# EAGLE board OOBDpiZero (EAGLE 7.2.0), part 1 of 2
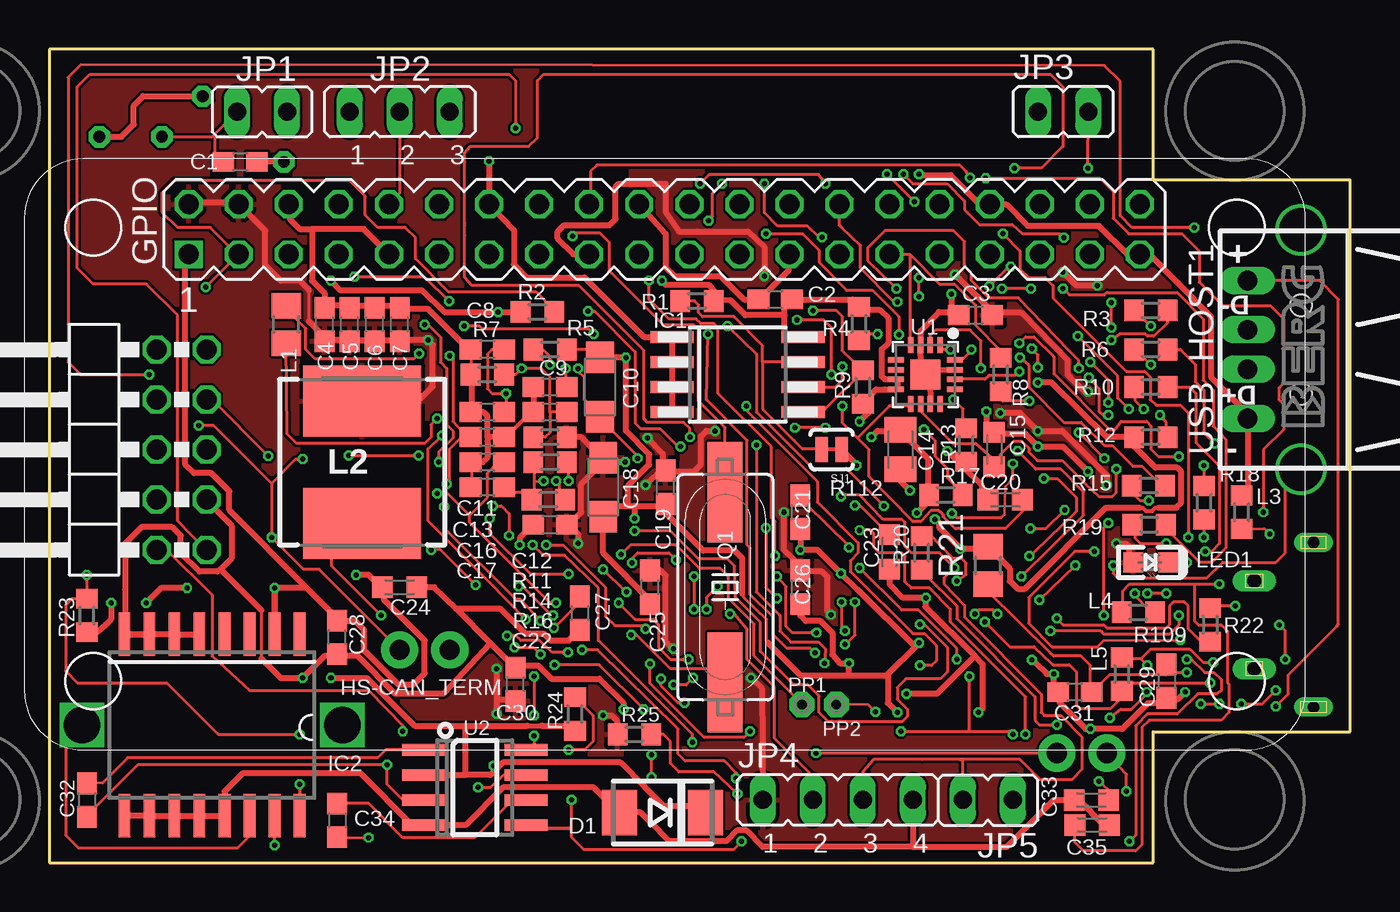
[diagram p3: board, top side]
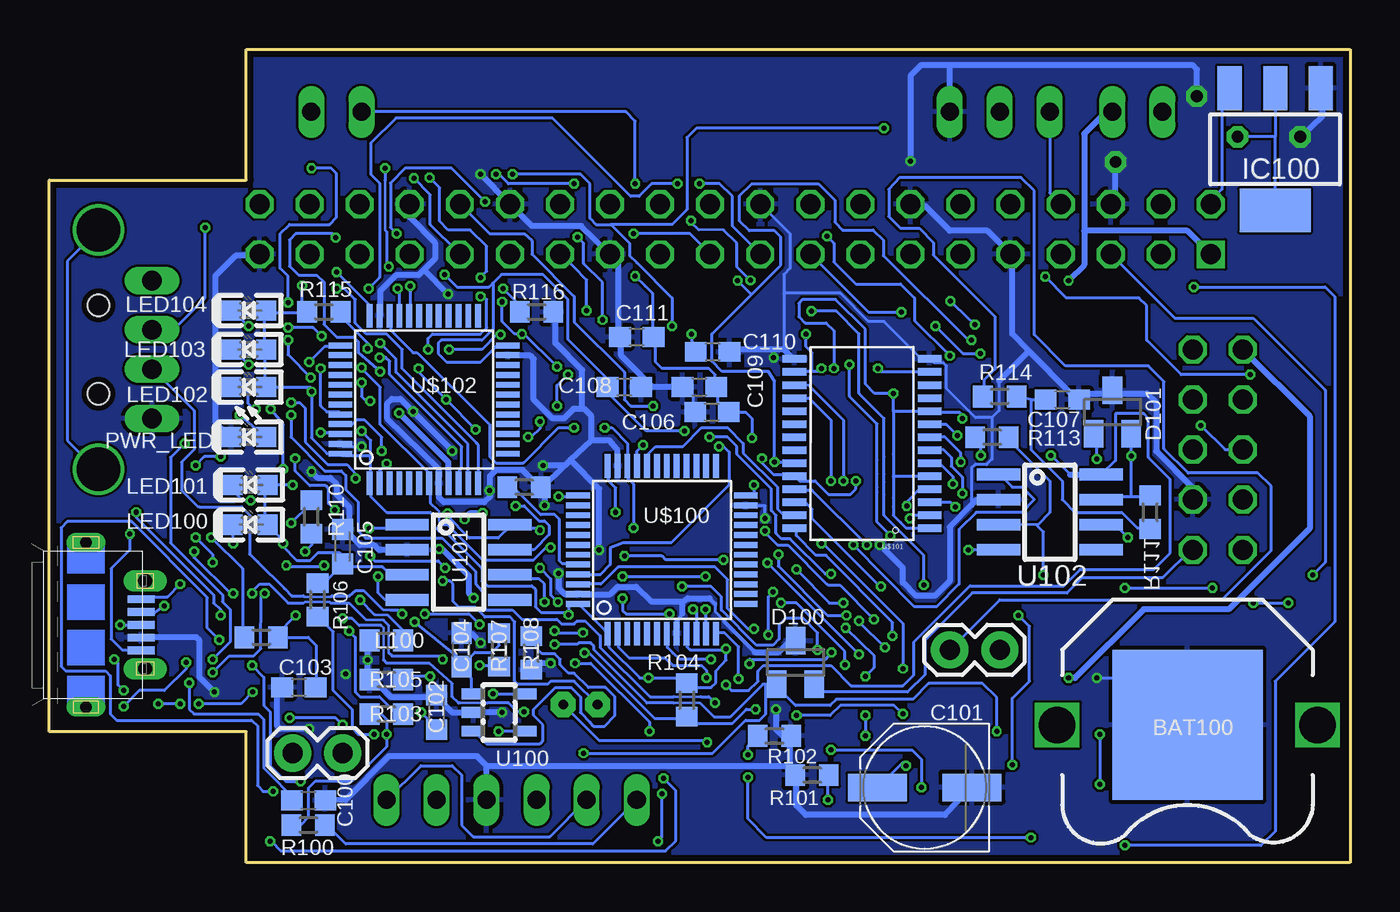
[diagram p4: board, bottom side, seen from below]

Size 66 x 41.27 mm. Coordinates in mm from the lower left corner, seen from the top.
Outline: 0,0 56,0 56,6.63 66,6.63 66,34.63 56,34.63 56,41.27 0,41.27 0,0
Copper layers (1*16): Top 0.035mm / dielectric 1.5mm / Bottom 0.035mm
Design rules "PCB-POOL HighSpec": minimum track width 0.125mm, minimum drill 0.2mm, track to track 0.125mm, track to pad 0.125mm, pad to pad 0.125mm, via to via 0.125mm, smd to smd 0.125mm, copper to edge 0.3mm, drill to drill 0.2mm, minimum pad ring 0.2mm, minimum via ring 0.125mm, stop-mask expansion 0.075mm, vias tented up to drill 0mil, thermal gap 0.2mm
Net classes: 2 lan_sh: clearance 0.762 mm

## Footprints (pad centres in the part's own frame; a part is rotated, then mirrored left to right if it is on the bottom)
BATTCON_12MM_PTH = smd 7.62 x 7.62: GND 0,0 | drill 1.854 square: VCC@1 -6.604,0; VCC@2 6.604,0
C0603 = smd 1.1 x 1: 1 -0.85,0; 2 0.85,0
SMC_A = smd 1.6 x 1.4: + -1.5,0; - 1.5,0
C0805K = smd 1.3 x 1.6: 1 -1,0; 2 1,0
C0603K = smd 1.05 x 1.08: 1 -0.875,0; 2 0.875,0
PANASONIC_D = smd 3 x 1.4: + 2.4,0; - -2.4,0
DO214AA = smd 1.778 x 2.286: A 2.177,0; C -2.177,0
SOT23 = smd 1 x 1.4: 1 -0.95,-1.1; 2 0.95,-1.1; 3 0,1.1
PIZERO_THOUGH_HOLE = drill 1.016 square: 1 8.34,25.15 | drill 1.016 octagon: 2 8.34,27.69; 3 10.88,25.15; 4 10.88,27.69; 5 13.42,25.15; 6 13.42,27.69; 7 15.96,25.15; 8 15.96,27.69; 9 18.5,25.15; 10 18.5,27.69; 11 21.04,25.15; 12 21.04,27.69; 13 23.58,25.15; 14 23.58,27.69; 15 26.12,25.15; 16 26.12,27.69; 17 28.66,25.15; 18 28.66,27.69; 19 31.2,25.15; 20 31.2,27.69; 21 33.74,25.15; 22 33.74,27.69; 23 36.28,25.15; 24 36.28,27.69; 25 38.82,25.15; 26 38.82,27.69; 27 41.36,25.15; 28 41.36,27.69; 29 43.9,25.15; 30 43.9,27.69; 31 46.44,25.15; 32 46.44,27.69; 33 48.98,25.15; 34 48.98,27.69; 35 51.52,25.15; 36 51.52,27.69; 37 54.06,25.15; 38 54.06,27.69; 39 56.6,25.15; 40 56.6,27.69
1X02 = drill 1.016 pad 1.88: 1 0,0; 2 2.54,0
SOIC8 = smd 0.6 x 2.2: 1 -1.905,-3.33; 2 -0.635,-3.33; 3 0.635,-3.33; 4 1.905,-3.33; 5 1.905,3.33; 6 0.635,3.33; 7 -0.635,3.33; 8 -1.905,3.33
SOIC-16W = smd 0.6 x 2.2: 1 -4.445,-4.6; 2 -3.175,-4.6; 3 -1.905,-4.6; 4 -0.635,-4.6; 5 0.635,-4.6; 6 1.905,-4.6; 7 3.175,-4.6; 8 4.445,-4.6; 9 4.445,4.6; 10 3.175,4.6; 11 1.905,4.6; 12 0.635,4.6; 13 -0.635,4.6; 14 -1.905,4.6; 15 -3.175,4.6; 16 -4.445,4.6
SOT223 = smd 1.219 x 2.235: 1 -2.311,-3.099; 2 0,-3.099; 3 2.311,-3.099 | smd 3.6 x 2.2: TAB 0,3.099
JP1 = drill 0.914 long: 1 0,-1.27; 2 0,1.27
JP2 = drill 0.914 long: 1 -2.54,0; 2 0,0; 3 2.54,0
JP4 = drill 0.914 long: 1 -3.81,0; 2 -1.27,0; 3 1.27,0; 4 3.81,0
L0805@1 = smd 1.3 x 1.5: 1 -0.95,0; 2 0.95,0
8X8MM_3131 = smd 3.6 x 6: 1 -3.1,0; 2 3.1,0
L0603 = smd 1 x 1.1: 1 -0.85,0; 2 0.85,0
LED_0603 = smd 1.016 x 1.016: A 0.889,0; C -0.889,0
2X05/90 = drill 1.016 octagon: 1 -5.08,-6.35; 2 -5.08,-3.81; 3 -2.54,-6.35; 4 -2.54,-3.81; 5 0,-6.35; 6 0,-3.81; 7 2.54,-6.35; 8 2.54,-3.81; 9 5.08,-6.35; 10 5.08,-3.81
P1-11 = drill 0.5 pad 1.27 octagon: P$1 0,0
LED-0603 = smd 1.016 x 1.016: A 0.889,0; C -0.889,0
SM49 = smd 5.08 x 1.778: 1 -4.826,0; 2 4.826,0
R0603 = smd 1 x 1.1: 1 -0.85,0; 2 0.85,0
R0805 = smd 1.3 x 1.5: 1 -0.95,0; 2 0.95,0
SJ_2S-TRACE = smd 0.635 x 1.27: 1 -0.508,0; 2 0.508,0
QFN16_3MM = smd 0.8 x 0.28: 1 -1.5,0.75; 2 -1.5,0.25; 3 -1.5,-0.25; 4 -1.5,-0.75; 9 1.5,-0.75; 10 1.5,-0.25; 11 1.5,0.25; 12 1.5,0.75 | smd 0.28 x 0.8: 5 -0.75,-1.5; 6 -0.25,-1.5; 7 0.25,-1.5; 8 0.75,-1.5; 13 0.75,1.5; 14 0.25,1.5; 15 -0.25,1.5; 16 -0.75,1.5 | smd 1.5 x 1.5: THERMAL 0,0
SOIC8' = smd 0.6 x 2.2: 1 -1.905,-2.6; 2 -0.635,-2.6; 3 0.635,-2.6; 4 1.905,-2.6; 5 1.905,2.6; 6 0.635,2.6; 7 -0.635,2.6; 8 -1.905,2.6
SOT23-5 = smd 1.2 x 0.55: 1 1.3,-0.95; 2 1.3,0; 3 1.3,0.95; 4 -1.3,0.95; 5 -1.3,-0.95
SO-08 = smd 0.6 x 2.2: 1 -1.905,-2.6; 2 -0.635,-2.6; 3 0.635,-2.6; 4 1.905,-2.6; 5 1.905,2.6; 6 0.635,2.6; 7 -0.635,2.6; 8 -1.905,2.6
LQFP48 = smd 0.3 x 1.2: 1 -2.75,-4.25; 2 -2.25,-4.25; 3 -1.75,-4.25; 4 -1.25,-4.25; 5 -0.75,-4.25; 6 -0.25,-4.25; 7 0.25,-4.25; 8 0.75,-4.25; 9 1.25,-4.25; 10 1.75,-4.25; 11 2.25,-4.25; 12 2.75,-4.25; 25 2.75,4.25; 26 2.25,4.25; 27 1.75,4.25; 28 1.25,4.25; 29 0.75,4.25; 30 0.25,4.25; 31 -0.25,4.25; 32 -0.75,4.25; 33 -1.25,4.25; 34 -1.75,4.25; 35 -2.25,4.25; 36 -2.75,4.25 | smd 1.2 x 0.3: 13 4.25,-2.75; 14 4.25,-2.25; 15 4.25,-1.75; 16 4.25,-1.25; 17 4.25,-0.75; 18 4.25,-0.25; 19 4.25,0.25; 20 4.25,0.75; 21 4.25,1.25; 22 4.25,1.75; 23 4.25,2.25; 24 4.25,2.75; 37 -4.25,2.75; 38 -4.25,2.25; 39 -4.25,1.75; 40 -4.25,1.25; 41 -4.25,0.75; 42 -4.25,0.25; 43 -4.25,-0.25; 44 -4.25,-0.75; 45 -4.25,-1.25; 46 -4.25,-1.75; 47 -4.25,-2.25; 48 -4.25,-2.75
TSSOP28 = smd 1.2 x 0.38: 1 -3.429,4.623; 2 -3.429,3.962; 3 -3.429,3.302; 4 -3.429,2.642; 5 -3.429,1.981; 6 -3.429,1.321; 7 -3.429,0.66; 8 -3.435,0; 9 -3.429,-0.66; 10 -3.429,-1.321; 11 -3.429,-1.981; 12 -3.429,-2.642; 13 -3.429,-3.302; 14 -3.429,-3.962; 15 3.429,-3.962; 16 3.429,-3.302; 17 3.429,-2.642; 18 3.429,-1.981; 19 3.429,-1.321; 20 3.429,-0.66; 21 3.435,0; 22 3.429,0.66; 23 3.429,1.321; 24 3.429,1.981; 25 3.429,2.642; 26 3.429,3.302; 27 3.429,3.962; 28 3.429,4.623
USB_PN87520_DEV_PTH = drill 1 long: 1 3.5,2.71; 2 1,2.71; 3 -1,2.71; 4 -3.5,2.71 | drill 2.2: P$1 6.07,0; P$2 -6.07,0 | hole 1.1: -2.25,0; 2.25,0
47589-0001 = smd 1.35 x 0.4: 1 2.8,1.3; 2 2.8,0.65; 3 2.8,0; 4 2.8,-0.65; 5 2.8,-1.3 | drill 0.6 pad 0.95 long: CASING1 0,4.175; CASING2 0,-4.175 | drill 0.7 pad 1.1 long: CASING3 3,2.225; CASING4 3,-2.225

## Placement (x,y rotation side)
BAT100  3,6V  [BATTCON_12MM_PTH]  8.26,6.98 180 bottom
C1  10uF/6.3V  [C0603]  9.68,35.56 0 top
C2  100nF  [C0603]  36.83,28.58 0 top
C3  100nF  [C0603]  46.99,27.78 0 top
C4  22uF/6.3V  [C0603]  13.97,27.31 90 top
C5  22uF/6.3V  [C0603]  15.24,27.31 90 top
C6  22uF/6.3V  [C0603]  16.51,27.31 90 top
C7  22uF/6.3V  [C0603]  17.78,27.31 90 top
C8  100nF  [C0603]  22.23,26.04 180 top
C9  100nF  [C0603]  25.4,24.13 180 top
C10  22uF/6.3V  [SMC_A]  27.94,24.13 90 top
C11  100nF  [C0603]  22.23,22.86 180 top
C12  1uF  [C0603]  25.4,22.86 180 top
C13  33pF  [C0603]  22.23,21.59 0 top
C14  10uF  [C0805K]  43.18,20.96 270 top
C15  220pF  [C0603K]  47.94,20.96 270 top
C16  33pF  [C0603]  22.23,20.32 180 top
C17  100nF  [C0603]  22.23,19.05 180 top
C18  22uF/6.3V  [SMC_A]  28.1,19.05 270 top
C19  100nF  [C0603]  31.27,19.05 90 top
C20  220pF  [C0603K]  48.5,18.42 0 top
C21  100nF  [C0603]  38.1,17.78 90 top
C22  100nF  [C0603]  25.4,17.15 180 top
C23  100nF  [C0603K]  42.62,15.76 90 top
C24  100nF  [C0603K]  17.78,13.97 0 top
C25  100nF  [C0603]  30.48,13.97 90 top
C26  100nF  [C0603]  38.1,13.97 90 top
C27  100nF  [C0603]  26.91,12.66 270 top
C28  1uF  [C0603]  14.61,11.43 90 top
C29  22uF/6.3V  [C0603]  56.67,9.21 270 top
C30  10uF/6.3V  [C0603]  23.65,9.05 90 top
C31  22uF/6.3V  [C0603]  52.03,8.65 180 top
C32  10nF  [C0603]  1.91,3.17 270 top
C33  100nF  [C0603K]  52.86,3.17 180 top
C34  3.3nF  [C0603]  14.61,2.14 270 top
C35  100nF  [C0603K]  52.9,1.91 0 top
C100  22uF/6.3V  [C0603]  52.85,3.16 0 bottom
C101  470uF/25V/LOWESR/105C  [PANASONIC_D]  21.59,3.81 180 bottom
C102  100nF  [C0603K]  46.35,7.62 90 bottom
C103  NI (10nF)  [C0603]  53.34,8.89 180 bottom
C104  22uF/6.3V  [C0603]  45.09,10.79 90 bottom
C105  100nF  [C0603K]  51.12,16.03 90 bottom
C106  100nF  [C0603]  32.38,22.86 0 bottom
C107  NI (10nF)  [C0603]  14.61,23.5 0 bottom
C108  100nF  [C0603]  36.83,24.13 180 bottom
C109  100nF  [C0603]  33.02,24.13 0 bottom
C110  100nF  [C0603]  32.35,25.92 180 bottom
C111  100nF  [C0603]  36.2,26.67 0 bottom
D1  SMBJ16A  [DO214AA]  31.11,2.54 180 top
D100  PESD1CAN  [SOT23]  28.14,10.16 0 bottom
D101  PESD1CAN  [SOT23]  12.06,22.86 0 bottom
GPIO  OOBDpiZero  [PIZERO_THOUGH_HOLE]  -1.27,5.71 0 top
HS-CAN_TERM  OPEN  [1X02]  17.78,10.79 180 bottom
IC1  EEPROM24  [SOIC8]  34.92,24.77 270 top
IC2  DS3231  [SOIC-16W]  8.26,6.98 180 top
IC100  LM1117MPX-3.3  [SOT223]  3.81,36.2 180 bottom
JP1  3V3 power (opt)  [JP1]  10.79,38.1 90 top
JP2  UART  [JP2]  17.78,38.1 0 top
JP3  Audio-Out  [JP1]  51.44,38.1 270 top
JP4  Prog0_IO  [JP4]  40.01,3.17 0 top
JP5  Prog2_IO  [JP1]  47.62,3.17 90 top
L1  2508056017Y2  [L0805@1]  12.03,27.31 90 top
L2  10uH/3.15A/20%  [8X8MM_3131]  15.88,20.32 90 top
L3  FB0805/600R/2A  [L0603]  60.48,17.78 270 top
L4  FB0805/600R/2A  [L0603]  55.24,12.7 180 top
L5  FB0805/600R/2A  [L0603]  54.41,9.56 90 top
L100  FB0805/600R/2A  [L0603]  48.9,11.27 0 bottom
LED1  yel  [LED_0603]  55.88,15.24 180 top
LED100  red  [LED_0603]  55.8,17.15 0 bottom
LED101  gr  [LED_0603]  55.8,19.17 0 bottom
LED102  yel  [LED_0603]  55.88,24.13 0 bottom
LED103  gr  [LED_0603]  55.88,26.04 0 bottom
LED104  red  [LED_0603]  55.88,28.02 0 bottom
MS-CAN_TERM  OPEN  [1X02]  51.12,5.56 180 bottom
OOBD2-CONNECTOR1  In-Car Diagnostic  [2X05/90]  1.64,20.96 90 top
PP1  PTR1PAD1-11  [P1-11]  38.18,8.02 0 top
PP2  PTR1PAD1-11  [P1-11]  39.93,8.02 0 top
PWR_LED  LED/Red/0603  [LED-0603]  55.88,21.59 0 bottom
Q1  12MHz  [SM49]  34.29,13.97 270 top
R1  10k  [R0603]  32.86,28.5 180 top
R2  10k  [R0603]  24.77,27.94 0 top
R3  330R  [R0603]  55.88,28.02 0 top
R4  10k  [R0603]  41.08,27.34 270 top
R5  680R  [R0603]  25.4,26.04 180 top
R6  330R  [R0603]  55.88,26.04 0 top
R7  NA(47k)  [R0603]  22.23,24.77 0 top
R8  1M  [R0603]  48.26,24.77 270 top
R9  10k  [R0603]  41.27,24.13 90 top
R10  330R  [R0603]  55.88,24.13 0 top
R11  10k  [R0603]  25.4,21.59 180 top
R12  2.2k/1%  [R0603]  55.88,21.59 0 top
R13  NI  [R0603]  46.51,21.19 90 top
R14  10k  [R0603]  25.4,20.32 180 top
R15  330R  [R0603]  55.76,19.13 0 top
R16  10k  [R0603]  25.32,18.42 180 top
R17  NI  [R0603]  45.48,18.65 180 top
R18  330R  [R0603]  58.58,18.26 90 top
R19  330R  [R0603]  55.8,17.15 0 top
R20  NI(0R)  [R0603]  44.25,15.72 90 top
R21  NI(0R)  [R0805]  47.62,15.08 90 top
R22  NI(0R)  [R0603]  58.9,12.06 270 top
R23  10k  [R0603]  1.91,12.54 90 top
R24  10k  [R0603]  26.67,7.54 90 top
R25  4.99k/1%  [R0603]  29.69,6.51 180 top
R100  NI  [R0603]  52.86,1.91 0 bottom
R101  1.05k/1%  [R0603]  27.3,4.45 180 bottom
R102  2.2k/1%  [R0603]  29.21,6.43 0 bottom
R103  NI  [R0603]  48.9,7.54 0 bottom
R104  330R  [R0603]  33.66,8.26 270 bottom
R105  10k  [R0603]  48.9,9.29 0 bottom
R106  10k  [R0603]  52.39,13.33 90 bottom
R107  2.2k/1%  [R0603]  43.18,10.79 90 bottom
R108  6k8k/1%  [R0603]  41.55,10.64 90 bottom
R109  60R  [R0603]  55.24,11.43 180 bottom
R110  60R  [R0603]  52.7,17.54 270 bottom
R111  60R  [R0603]  10.16,17.78 90 bottom
R112  60R  [R0603]  41.91,19.05 0 bottom
R113  10k  [R0603]  18.18,21.59 0 bottom
R114  60R  [R0603]  17.78,23.65 180 bottom
R115  330R  [R0603]  52.07,27.94 0 bottom
R116  60R  [R0603]  41.27,27.94 0 bottom
SJ1  SOLDERJUMPERTRACE  [SJ_2S-TRACE]  39.69,20.96 180 top
U1  MAX98357  [QFN16_3MM]  44.45,24.77 270 top
U2  MP1482  [SOIC8']  21.59,3.81 270 top
U100  SY6280  [SOT23-5]  43.18,7.62 180 bottom
U101  SN65HVD230(SO8)  [SO-08]  45.24,15.24 270 bottom
U102  SN65HVD230(SO8)  [SO-08]  15.24,17.78 270 bottom
U$100  STM32F042CT  [LQFP48]  34.92,15.88 0 bottom
U$101  GL850G-31  [TSSOP28]  24.77,21.59 180 bottom
U$102  STM32F042CT  [LQFP48]  46.99,23.5 0 bottom
USB_HOST1  USB_A_VERTICAL  [USB_PN87520_DEV_PTH]  63.5,26.04 90 top
USB_HOST100  USB_A_VERTICAL  [47589-0001]  64.14,12.06 0 bottom